# Altium schematic sheet ABZ_M1_M2.SchDoc
size A4; SheetNumber: 8; SheetTotal: 9
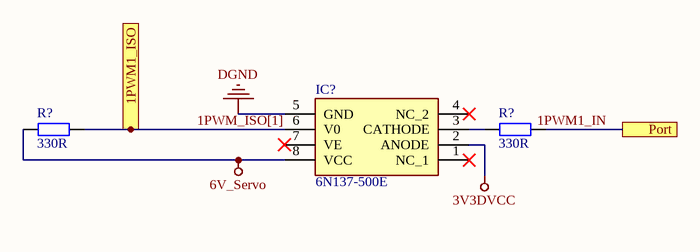
[diagram p0: ABZ_M1_M2.SchDoc]

## Parts
(Parts that share a designator on the sheet are numbered #1, #2 ... from top to bottom, then left to right.)
IC?  6N137-500E  [SOP254P1030X508-8N]
R?#1  330R  [R 0805_L]
R?#2  330R  [R 0805_L]

## Ports
1PWM1_ISO, Port

## Nets
3V3DVCC: IC?.2(ANODE)
6V_Servo: IC?.8(VCC) R?#1.1
DGND: IC?.5(GND)
1PWM1_IN: R?#2.1 ; port Port
1PWM_ISO[1]: IC?.6(V0) R?#1.2 ; port 1PWM1_ISO
NetIC?_3: IC?.3(CATHODE) R?#2.2

Not connected (* = marked no-connect by the designer): IC? 1(NC_1)* 4(NC_2)* 7(VE)*

## Library data of the parts
IC? = 6N137-500E: Integrated Circuit; Manufacturer_Name: Avago Technologies; Datasheet Link: https://componentsearchengine.com//6N137-500E.pdf; Height: 4.7mm; Mouser2 Part Number: 630-6N137-500E; Mouser2 Price/Stock: https://www.mouser.com/Search/Refine.aspx?Keyword=630-6N137-500E; Manufacturer_Part_Number: 6N137-500E
R?#1 R?#2 = R: 贴片电阻; 版权归属: 来自淘宝 ID：黄晶宝石; 封装库来自淘宝卖家 ID：黄晶宝石: 其他店铺购入均为盗版，不享受售后技术支持服务，请立即申请退款; BOM名称: 贴片电阻; 联系售后: https://shop463601444.taobao.com